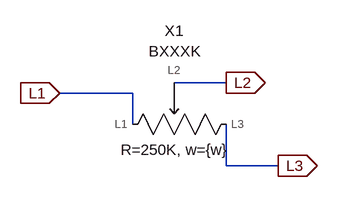
[diagram p0: schematic B250K.asc]
B250K.asc, the LTspice schematic file:
Version 4
SHEET 1 880 680
WIRE 224 160 144 160
WIRE 80 176 -32 176
WIRE 80 224 80 176
WIRE 224 288 224 224
WIRE 304 288 224 288
FLAG -32 176 L1
IOPIN -32 176 In
FLAG 224 160 L2
IOPIN 224 160 Out
FLAG 304 288 L3
IOPIN 304 288 Out
SYMBOL Base_BxxxK 144 176 R0
WINDOW 39 1 87 Center 2
SYMATTR SpiceLine R=250K, w={w}
SYMATTR InstName X1
SYMATTR Description May be used for modeling linear potentiometers. Parameters: R, x. By default, R = 100 ohms and x is undefined. x must be within the range of [0, 1]. At x = 0, there will be no output signal.

The netlist it stands for:
* B250K.asc
XX1 L1 L2 L3 BXXXK R=250K, w={w}  ; pins L1 L2 L3
.backanno
.end